# Altium schematic sheet LTE+GPS_Power.SchDoc
size 420 x 297 mm
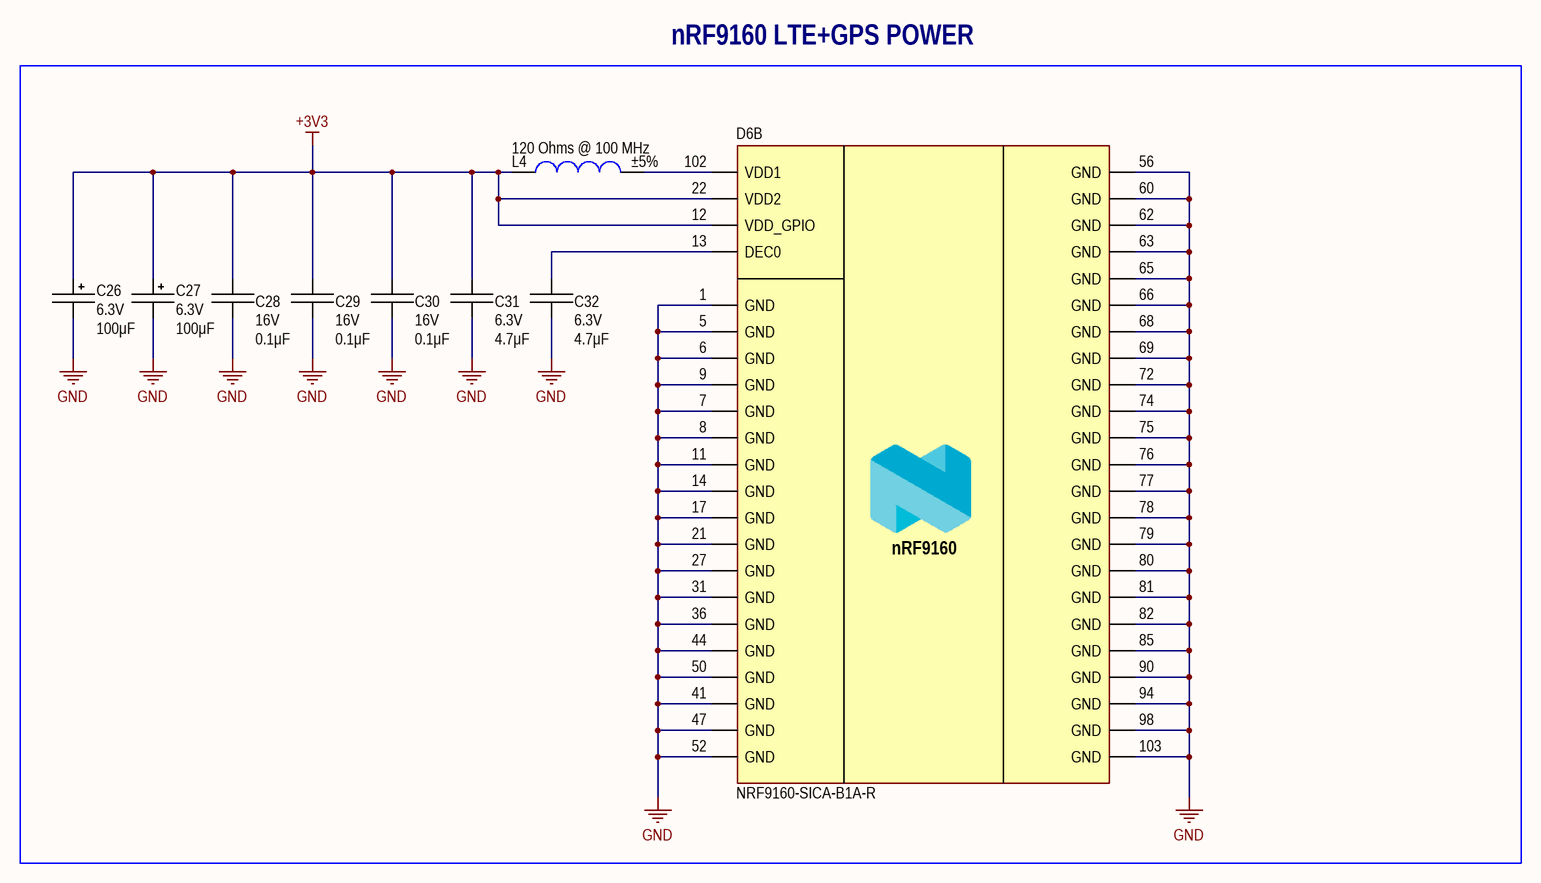
[diagram p0: LTE+GPS_Power.SchDoc]

## Parts
C26  value 100μF  Voltage: 6.3V  [CAP: TANTAL-A]
C27  value 100μF  Voltage: 6.3V  [CAP: TANTAL-A]
C28  value 0.1μF  Voltage: 16V  [CAP: 0402_NO_SILK]
C29  value 0.1μF  Voltage: 16V  [CAP: 0402_NO_SILK]
C30  value 0.1μF  Voltage: 16V  [CAP: 0402_NO_SILK]
C31  value 4.7μF  Voltage: 6.3V  [CAP: 0603_NO_SILK]
C32  value 4.7μF  Voltage: 6.3V  [CAP: 0603_NO_SILK]
D6  PartNumber: NRF9160-SICA-B1A-R  [MOD: NRF9160]  (part B of 3)
L4  value 120 Ohms @ 100 MHz  Tolerance: ±5%  [IND: 0402]

## Blocks framed on the sheet
nRF9160 LTE+GPS POWER: C26-C32 D6 L4

## Nets
+3V3: C26.1 C27.1 C28.2 C29.2 C30.2 C31.2 D6.12(VDD_GPIO) D6.22(VDD2) L4.2
GND: C26.2 C27.2 C28.1 C29.1 C30.1 C31.1 C32.1 D6.1(GND) D6.5(GND) D6.6(GND) D6.7(GND) D6.8(GND) D6.9(GND) D6.11(GND) D6.14(GND) D6.17(GND) D6.21(GND) D6.27(GND) D6.31(GND) D6.36(GND) D6.41(GND) D6.44(GND) D6.47(GND) D6.50(GND) D6.52(GND) D6.56(GND) D6.60(GND) D6.62(GND) D6.63(GND) D6.65(GND) D6.66(GND) D6.68(GND) D6.69(GND) D6.72(GND) D6.74(GND) D6.75(GND) D6.76(GND) D6.77(GND) D6.78(GND) D6.79(GND) D6.80(GND) D6.81(GND) D6.82(GND) D6.85(GND) D6.90(GND) D6.94(GND) D6.98(GND) D6.103(GND)
NetC32_2: C32.2 D6.13(DEC0)
NetD6_102: D6.102(VDD1) L4.1

## Notes on the sheet
- Author
- Manufacturer
- Date
- Page
- Total pages
- Size page
- A3
- Materials

## Library data of the parts
C26 C27 = Tantal_A: 100 µF Molded Tantalum Polymer Capacitor 6.3 V 1206 (3216 Metric) 100mOhm @ 100kHz; Manufacturer: AVX; PartNumber: TCJA107M006R0100; ValueManufacturerPartNumber: Tantalum capacitor, 100μF, 6.3V, ±10%, 100 mOhm, case A (3216), -55...+125°C; Tolerance: ±10%; TypeDielectric: X7R; TypeCapacitor: Tantalum capacitor; Package: case A (3216); HelpURL: https://www.digikey.com/en/products/detail/avx-corporation/TCJA107M006R0100/4990371; Temperature: -55...+125°C; Impedance: 100 mOhm
C28-C30 = Ceramic_0402: 0.1 µF ±10% 16V Ceramic Capacitor X7R 0402 (1005 Metric); Manufacturer: Yageo; PartNumber: CC0402KRX7R7BB104; ValueManufacturerPartNumber: Ceramic capacitor, 0.1μF, X7R, ±10%, 16V, 0402, -55...+125°C; Package: 0402; HelpURL: https://www.digikey.com/product-detail/en/yageo/CC0402KRX7R7BB104/311-1338-1-ND/2103122; Temperature: -55...+125°C; TypeCapacitor: Ceramic capacitor; Tolerance: ±10%; TypeDielectric: X7R
C31 C32 = Ceramic_0603: 4.7 µF ±20% 6.3V Ceramic Capacitor X7R 0603 (1608 Metric); Manufacturer: Yageo; PartNumber: CC0603MRX7R5BB475; ValueManufacturerPartNumber: Ceramic capacitor, 4.7μF, X7R, ±10%, 6.3V, 0603, -55...+125°C; Tolerance: ±10%; Package: 0603; HelpURL: https://www.digikey.com/en/products/detail/yageo/CC0603MRX7R5BB475/7164380; Temperature: -55...+125°C; TypeCapacitor: Ceramic capacitor; TypeDielectric: X7R
D6 = nRF9160: LTE/GSM module; Manufacturer: Nordic Semiconductor; Supply: 3...5.5V; Frequency: 2.4GHz; TypeProtocol: LTE-M/NB-IoT/GPS; HelpURL: https://www.digikey.com/en/products/detail/nordic-semiconductor-asa/NRF9160-SICA-B1A-R/13533595; Package: 127-LGA; ComponentType: LTE/GSM module; ValueManufacturerPartNumber: =ComponentType+', '+TypeProtocol+', '+Frequency+', '+CoreSize+', '+CoreProcessor+', '+MemoryROM+', '+MemoryRAM+', '+Supply+', '+Temperature+', '+Package; Temperature: -40...+85°C
L4 = Inductor_0402: 120 Ohms @ 100 MHz 1 Power Line Ferrite Bead 0402 (1005 Metric) 2A 55mOhm; Manufacturer: Murata Electronics; PartNumber: BLM15PX121SN1D; ValueManufacturerPartNumber: Fixed inductor, 120 Ohms @ 100 MHz, ±5%, 0402, 2A, -55...+125°C; TypeInductor: Fixed inductor; Package: 0402; HelpURL: https://www.digikey.com/en/products/detail/murata-electronics/BLM15PX121SN1D/4421095; Temperature: -55...+125°C; MaxCurrent: 2A